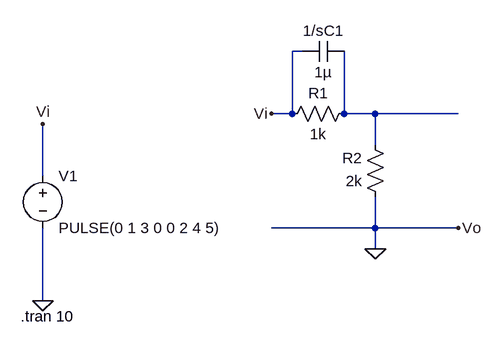
[diagram p0: schematic lead_compensator.asc]
lead_compensator.asc, the LTspice schematic file:
Version 4
SHEET 1 1532 1056
WIRE -1536 224 -1552 224
WIRE -1552 320 -1552 224
WIRE -1552 320 -1584 320
WIRE -1472 320 -1472 224
WIRE -1424 320 -1472 320
WIRE -1296 320 -1424 320
WIRE -1424 368 -1424 320
WIRE -1936 416 -1936 336
WIRE -1424 496 -1424 448
WIRE -1424 496 -1584 496
WIRE -1296 496 -1424 496
WIRE -1424 528 -1424 496
WIRE -1936 608 -1936 496
FLAG -1936 608 0
FLAG -1584 320 Vi
FLAG -1296 496 Vo
FLAG -1936 336 Vi
FLAG -1424 528 0
SYMBOL voltage -1936 400 R0
WINDOW 123 0 0 Left 0
WINDOW 39 0 0 Left 0
SYMATTR InstName V1
SYMATTR Value PULSE(0 1 3 0 0 2 4 5)
SYMBOL res -1456 304 R90
WINDOW 0 0 56 VBottom 2
WINDOW 3 32 56 VTop 2
SYMATTR InstName R1
SYMATTR Value 1k
SYMBOL res -1408 464 R180
WINDOW 0 36 76 Left 2
WINDOW 3 36 40 Left 2
SYMATTR InstName R2
SYMATTR Value 2k
SYMBOL cap -1472 208 R90
WINDOW 0 0 32 VBottom 2
WINDOW 3 32 32 VTop 2
SYMATTR InstName 1/sC1
SYMATTR Value 1µ
TEXT -1970 632 Left 2 !.tran 10

The netlist it stands for:
* lead_compensator.asc
V1 Vi 0 PULSE(0 1 3 0 0 2 4 5)
R1 N001 Vi 1k
R2 0 N001 2k
C§1/sC1 N001 Vi 1µ
.tran 10
.backanno
.end